# Altium schematic sheet Wireless_and_DSP.SchDoc
size A; SheetNumber: 4; SheetTotal: 4
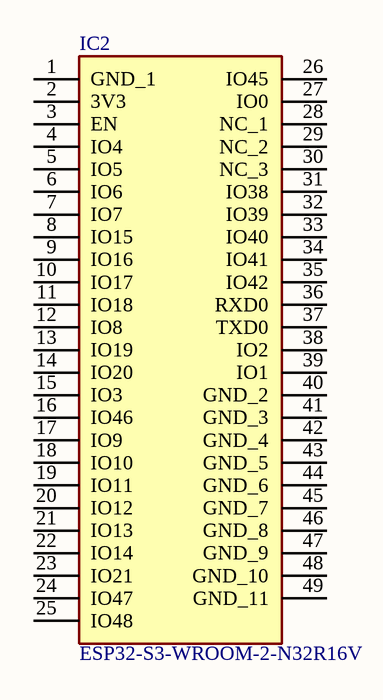
[diagram p0: Wireless_and_DSP.SchDoc]

## Parts
IC2  ESP32-S3-WROOM-2-N32R16V  [ESP32S3WROOM2N32R16V]

## Nets

Not connected (* = marked no-connect by the designer): IC2 1(GND_1) 2(3V3) 3(EN) 4(IO4) 5(IO5) 6(IO6) 7(IO7) 8(IO15) 9(IO16) 10(IO17) 11(IO18) 12(IO8) 13(IO19) 14(IO20) 15(IO3) 16(IO46) 17(IO9) 18(IO10) 19(IO11) 20(IO12) 21(IO13) 22(IO14) 23(IO21) 24(IO47) 25(IO48) 26(IO45) 27(IO0) 28(NC_1) 29(NC_2) 30(NC_3) 31(IO38) 32(IO39) 33(IO40) 34(IO41) 35(IO42) 36(RXD0) 37(TXD0) 38(IO2) 39(IO1) 40(GND_2) 41(GND_3) 42(GND_4) 43(GND_5) 44(GND_6) 45(GND_7) 46(GND_8) 47(GND_9) 48(GND_10) 49(GND_11)

## Library data of the parts
IC2 = ESP32-S3-WROOM-2-N32R16V: Integrated Circuit; Manufacturer_Name: Espressif Systems; Datasheet Link: https://www.espressif.com/sites/default/files/documentation/esp32-s3-wroom-2_datasheet_en.pdf; Height: 3.25mm; Manufacturer_Part_Number: ESP32-S3-WROOM-2-N32R16V; Mouser Part Number: 356-SP32S3WM2N32R16V; Mouser Price/Stock: https://www.mouser.co.uk/ProductDetail/Espressif-Systems/ESP32-S3-WROOM-2-N32R16V?qs=%252BHhoWzUJg4Kf%2FwmS40wg%252BQ%3D%3D